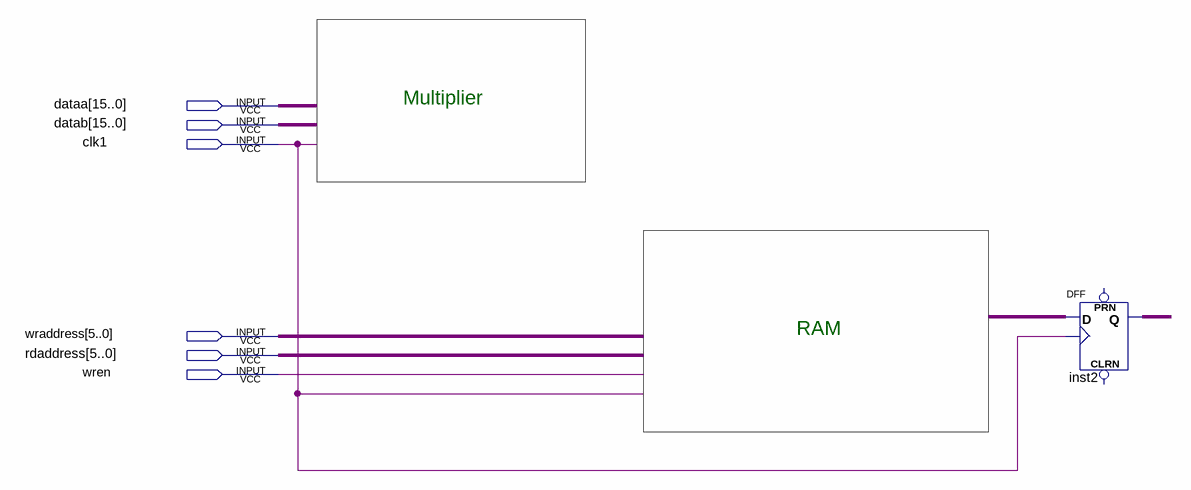
[diagram p0: schematic sheet]
// Quartus schematic pipemult.bdf as structural Verilog: 1 symbols, 6 pins
module pipemult (
  input  [15:0] dataa,
  input  [15:0] datab,
  input  clk1,
  input  [5:0] wraddress,
  input  [5:0] rdaddress,
  input  wren
);

  wire inst2_q, undriven;

  DFF inst2 (.CLK(clk1), .D(undriven), .Q(inst2_q));  // open: CLRN, PRN

  // Notes on the sheet:
  //   Multiplier
  //   RAM
endmodule
